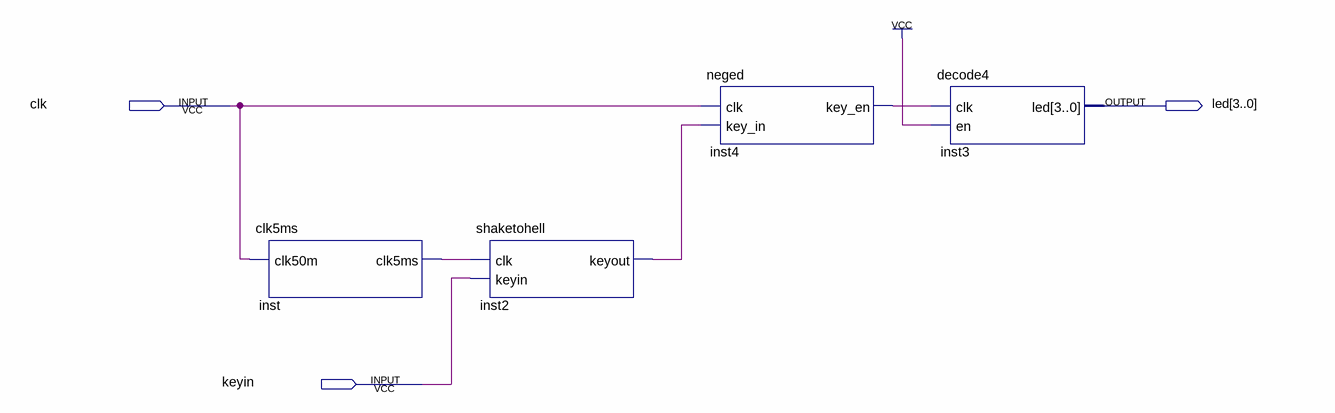
[diagram p0: schematic sheet]
// Quartus schematic Block2.bdf as structural Verilog: 4 symbols, 3 pins
module Block2 (
  input  clk,
  input  keyin,
  output [3:0] led
);

  wire inst2_keyout, inst4_key_en, inst_clk5ms;

  clk5ms inst (.clk50m(clk), .clk5ms(inst_clk5ms));
  shaketohell inst2 (.clk(inst_clk5ms), .keyin(keyin), .keyout(inst2_keyout));
  neged inst4 (.clk(clk), .key_in(inst2_keyout), .key_en(inst4_key_en));
  decode4 inst3 (.clk(inst4_key_en), .en(1'b1), .led(led));
endmodule
